# Altium schematic sheet MY_STM.SchDoc
size A; SheetNumber: 1; SheetTotal: 1
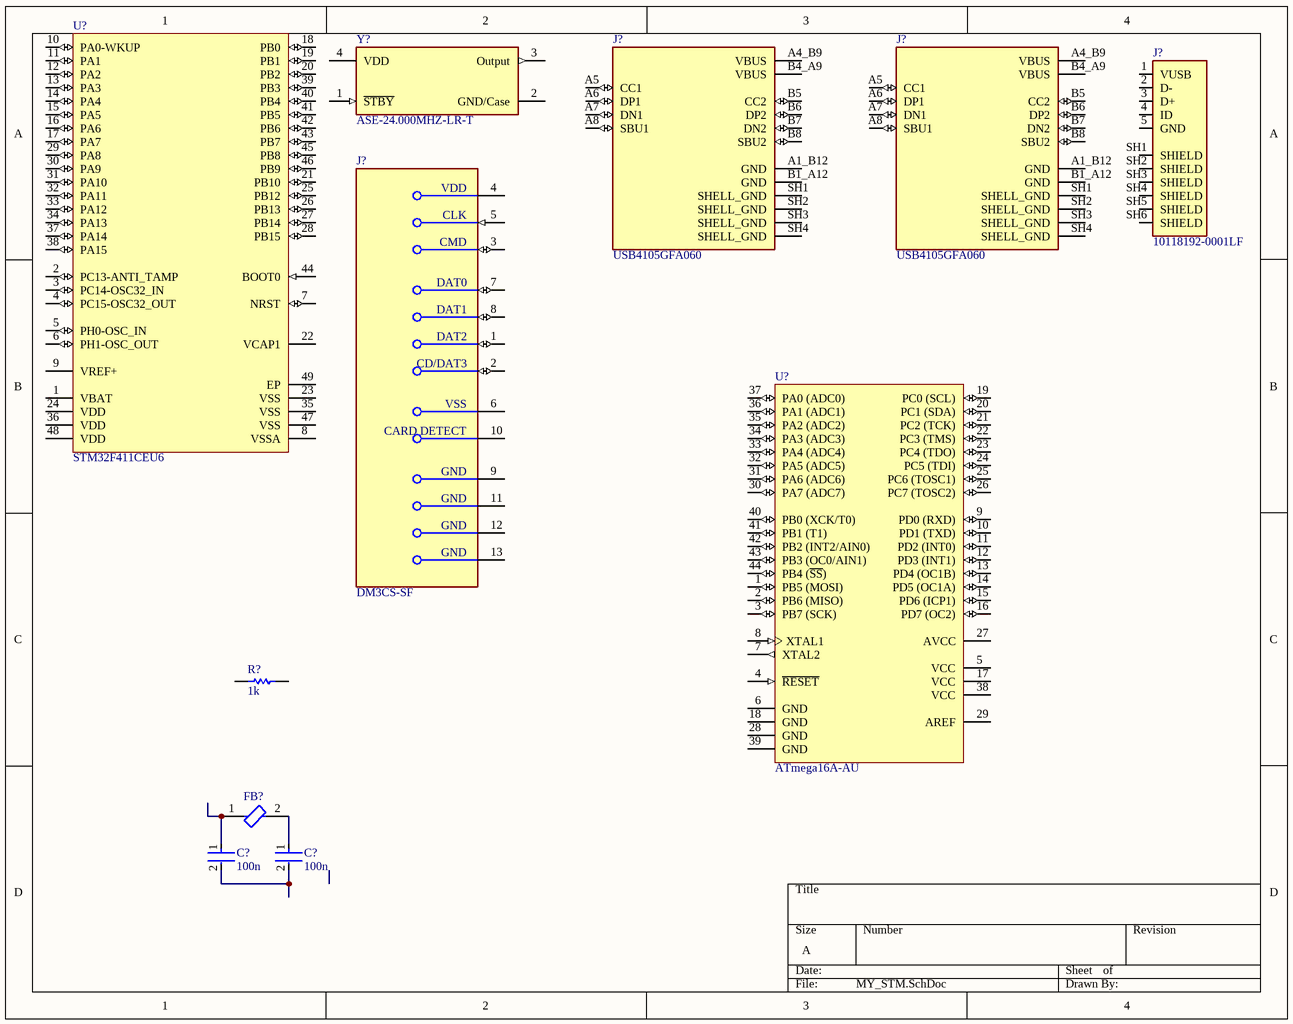
[diagram p0: MY_STM.SchDoc]

## Parts
(Parts that share a designator on the sheet are numbered #1, #2 ... from top to bottom, then left to right.)
C?#1  100n  [FP-CL10-IPC_C]
C?#2  100n  [FP-CL10-IPC_C]
FB?  BLM18KG121TN1D  [FP-BLM18-0_15-t0_6-d1_2-IPC_A]  (value not drawn)
J?#1  USB4105GFA060  [GCT_USB4105GFA060]
J?#2  USB4105GFA060  [GCT_USB4105GFA060]
J?#3  10118192-0001LF  [AMPHENOL_10118192-0001LF]
J?#4  DM3CS-SF  [FP-DM3CS-SF-MFG]
R?  1k  [RESC2013X60X35ML10T20]
U?#1  STM32F411CEU6  [STM-UFQFPN48_L]
U?#2  ATmega16A-AU  [44A_N]
Y?  ASE-24.000MHZ-LR-T  [FP-ASE-MFG]

## Nets
NetC?#1_1: C?#1.1 FB?.1
NetC?#1_2: C?#1.2 C?#2.2
NetC?#2_1: C?#2.1 FB?.2

Not connected (* = marked no-connect by the designer): J?#1 A1_B12(GND) A4_B9(VBUS) A5(CC1) A6(DP1) A7(DN1) A8(SBU1) B1_A12(GND) B4_A9(VBUS) B5(CC2) B6(DP2) B7(DN2) B8(SBU2) SH1(SHELL_GND) SH2(SHELL_GND) SH3(SHELL_GND) SH4(SHELL_GND); J?#2 A1_B12(GND) A4_B9(VBUS) A5(CC1) A6(DP1) A7(DN1) A8(SBU1) B1_A12(GND) B4_A9(VBUS) B5(CC2) B6(DP2) B7(DN2) B8(SBU2) SH1(SHELL_GND) SH2(SHELL_GND) SH3(SHELL_GND) SH4(SHELL_GND); J?#3 1(VUSB) 2(D-) 3(D+) 4(ID) 5(GND) SH1(SHIELD) SH2(SHIELD) SH3(SHIELD) SH4(SHIELD) SH5(SHIELD) SH6(SHIELD); J?#4 1(DAT2) 2(CD/DAT3) 3(CMD) 4(VDD) 5(CLK) 6(VSS) 7(DAT0) 8(DAT1) 9(GND) 10(CARD_DETECT) 11(GND) 12(GND) 13(GND); R? 1 2; U?#1 1(VBAT) 2(PC13-ANTI_TAMP) 3(PC14-OSC32_IN) 4(PC15-OSC32_OUT) 5(PH0-OSC_IN) 6(PH1-OSC_OUT) 7(NRST) 8(VSSA) 9(VREF+) 10(PA0-WKUP) 11(PA1) 12(PA2) 13(PA3) 14(PA4) 15(PA5) 16(PA6) 17(PA7) 18(PB0) 19(PB1) 20(PB2) 21(PB10) 22(VCAP1) 23(VSS) 24(VDD) 25(PB12) 26(PB13) 27(PB14) 28(PB15) 29(PA8) 30(PA9) 31(PA10) 32(PA11) 33(PA12) 34(PA13) 35(VSS) 36(VDD) 37(PA14) 38(PA15) 39(PB3) 40(PB4) 41(PB5) 42(PB6) 43(PB7) 44(BOOT0) 45(PB8) 46(PB9) 47(VSS) 48(VDD) 49(EP); U?#2 1(PB5_(MOSI)) 2(PB6_(MISO)) 3(PB7_(SCK)) 4(~{RESET}) 5(VCC) 6(GND) 7(XTAL2) 8(XTAL1) 9(PD0_(RXD)) 10(PD1_(TXD)) 11(PD2_(INT0)) 12(PD3_(INT1)) 13(PD4_(OC1B)) 14(PD5_(OC1A)) 15(PD6_(ICP1)) 16(PD7_(OC2)) 17(VCC) 18(GND) 19(PC0_(SCL)) 20(PC1_(SDA)) 21(PC2_(TCK)) 22(PC3_(TMS)) 23(PC4_(TDO)) 24(PC5_(TDI)) 25(PC6_(TOSC1)) 26(PC7_(TOSC2)) 27(AVCC) 28(GND) 29(AREF) 30(PA7_(ADC7)) 31(PA6_(ADC6)) 32(PA5_(ADC5)) 33(PA4_(ADC4)) 34(PA3_(ADC3)) 35(PA2_(ADC2)) 36(PA1_(ADC1)) 37(PA0_(ADC0)) 38(VCC) 39(GND) 40(PB0_(XCK/T0)) 41(PB1_(T1)) 42(PB2_(INT2/AIN0)) 43(PB3_(OC0/AIN1)) 44(PB4_(~{SS})); Y? 1(~{STBY}) 2(GND/Case) 3(Output) 4(VDD)

## Library data of the parts
C?#1 C?#2 = CMP-13271-003017-1: Cap Ceramic 4.7uF 10V X5R ±10% Pad SMD 0603 +85°C T/R; Capacitance: 4.7uF; Case/Package: 0603; Packaging: Tape and Reel; Width: 0.031inch; Contact Plating: Tin; Thickness: 0.035inch; Package Quantity: 1; Voltage Rating: 10V; Case Code (Metric): 1608; Case Code (Imperial): 0603; Depth: 0.8mm; Height: 0.8mm; Tolerance: 10%; Max Operating Temperature: 85°C; Length: 1.6mm; Dielectric: X5R; Mount: Surface Mount; Radiation Hardening: No; Min Operating Temperature: -55°C
FB? = CMP-0686-00554-8: FERRITE BEAD 120 OHM 0603 1LN; Max Current Rating: 3A; DC Resistance (DCR): 30mR; Impedance: 120R; Number of Lines: 1; Test Frequency: 100MHz; Tolerance: 25%; Package Quantity: 4000; Min Operating Temperature: -55°C; Termination: SMD/SMT; REACH SVHC: No SVHC; Core Material: Ferrite; Material: Ferrite; Current Rating: 3A; Height: 0.8mm; Number of Pins: 2; Case/Package: 0603; Case Code (Imperial): 0603; Series: BLM18K; Packaging: Tape and Reel; Inductor Type: FERRITE BEAD; Lead Free: Lead Free; Width: 0.8mm; Case Code (Metric): 1608; Number of Circuits: 1; Max DC Current: 3A; Depth: 0.95mm; Max Operating Temperature: 125°C; Length: 1.6mm; RoHS Compliant: Yes
J?#1 J?#2 = USB4105GFA060: MF: {'manufacturer': u'GCT'}; Package: None; Price: None; Value: *; MP: USB4105GFA060; Availability: Unavailable
J?#3 = 10118192-0001LF: Micro USB, Input Output Connectors, B TYPE RECEPTACLE with flange; MF: Amphenol ICC; Check_prices: https://www.snapeda.com/parts/10118192-0001LF/Amphenol+FCI/view-part/?ref=eda; Value: *; Availability: In Stock; MP: 10118192-0001LF; Price: None; Package: None; Purchase-URL: https://pricing.snapeda.com/search/part/10118192-0001LF/?ref=eda; SnapEDA_Link: https://www.snapeda.com/parts/10118192-0001LF/Amphenol+FCI/view-part/?ref=snap
J?#4 = CMP-11597-000003-1: CONN MICRO SD CARD HINGED TYPE; Pitch: 1.1mm; Connector Type: Connector; Current Rating: 500mA; Voltage Rating (AC): 125V; Gender: Female; Insulation Resistance: 1GR; Number of Positions: 8; Contact Resistance: 100mR; Packaging: Tape and Reel; Flammability Rating: UL94 V-0; Lead Free: Lead Free; Min Operating Temperature: -25°C; Orientation: Right Angle; Width: 13.8mm; Number of Rows: 1; Housing Material: Polymer; Package Quantity: 1; Mount: Surface Mount; Max Current Rating: 500mA; Radiation Hardening: No; Max Operating Temperature: 85°C; Contact Plating: Gold; Depth: 1.83mm; Contact Material: Gold; Length: 14.1mm; Number of Contacts: 8; Termination: Solder
R? = CMP-2100-03673-1: Chip Resistor, 0 Ohm, Jumper, +/- 5%, 0.125 W, -55 to 155 degC, 0805 (2012 Metric), RoHS, Tape and Reel; Manufacturer: Yageo; Power Rating: 125mW; Resistance: 0mOhm; Voltage Rating (DC): 150V; Temperature Coefficient: 200ppm/degreesC; Height: 0.5mm; Depth: 1.25mm; Case Code (Imperial): 0805; Lead Free: LeadFree; Military Standard: Not; Package Description: 2-Pin Surface Mounted Device, Body 2 x 1.25 mm; Case Code (Metric): 2012; Composition: ThickFilm; Voltage Rating: 150V; Manufacturer URL: http://www.yageo.com/; Packaging: TapeandReel; Package Reference: 0805; REACH SVHC: Unknown; Tolerance: 5%; Case/Package: 0805; Max Operating Temperature: 155degC; Number of Pins: 2; Min Operating Temperature: -55degC; RoHSCompliant: true; Length: 2mm; Datasheet URL: http://www.yageo.com/NewPortal/yageodocoutput?fileName=/pdf/R-Chip/PYu-RC_Group_51_RoHS_L_5.pdf; Termination: SMD/SMT; Radiation Hardening: No; Width: 1.25mm; Contact Plating: Tin; Datasheet Version: Rev. 5, 10/2016
U?#1 = CMP-0243-00165-1: ARM Cortex-M4 32-bit MCU+FPU, 512 KB Flash, 128 KB RAM, 36 I/Os, 48-Pin UFQFPN, -40 to 85 degC, Tray; Operating Frequency(F) (Processor speed) (MHz): 100; FLASH Size (Prog) (kB): 512; Internal RAM Size (kB): 128; I/Os (High Current): 36; Supply Voltage(Vcc) min (V): 1.7; Package Reference: 48-Pin Ultra Thin Fine Pitch Quad Flat No-Lead, 7 x 7 x 0.6 mm Body, 0.5 mm Pitch, Exposed Pad; ComponentLink1Description: Manufacturer URL; ComponentLink1URL: http://www.st.com/; Packing: Tray; Package Description: UFQFPN48; Core: ARM Cortex-M4; ComponentLink2Description: Datasheet; ComponentLink2URL: http://www.st.com/st-web-ui/static/active/en/resource/technical/document/datasheet/DM00115249.pdf; DatasheetVersion: Rev. 6; Mounting Technology: Surface Mount
U?#2 = CMP-0095-00302-2: 8-bit AVR Microcontroller, 16KB Flash, 512 Bytes EEPROM, 1KB SRAM, 44-pin TQFP, Industrial Grade (-40°C to 85°C); ComponentLink3URL: http://www.atmel.com/dyn/resources/prod_documents/8154S.pdf; PackageVersion: revC, Oct-2010; PackageReference: 44A; ComponentLink3Description: ATmega16A Summary; DatasheetVersion: revB, Jul-2009; ComponentLink2URL: http://www.atmel.com/dyn/resources/prod_documents/doc8154.pdf; PackageDescription: 44-Pin Plastic Thin Profile Quad Flat Pack, 10 x 10 x 1.0 mm Body, 0.8 mm Pitch (TQFP); RevisionNote: PackageVersion updated. URLs added.; Code_JEDEC: MS-026-ACB; ComponentLink1Description: Manufacturer URL; ComponentLink2Description: ATmega16A Datasheet; ComponentLink1URL: http://www.atmel.com/
Y? = CMP-27762-001392-1: XTAL Oscillator 24MHz ±25ppm CMOS 3.3V 4-SMD 3.2mm x 2.5mm; Max Supply Current: 13mA; Load Capacitance: 15pF; Packaging: Tape and Reel; Case/Package: SMD/SMT; Number of Pins: 4; Max Operating Temperature: 85°C; Min Operating Temperature: -40°C; Package Quantity: 1000; Operating Supply Voltage: 3.3V; Lead Free: Lead Free; Height: 0.047inch; Frequency Stability: 25ppm; Series: ASE; Frequency: 24MHz; Length: 0.126inch; Width: 0.098inch; Mount: Surface Mount